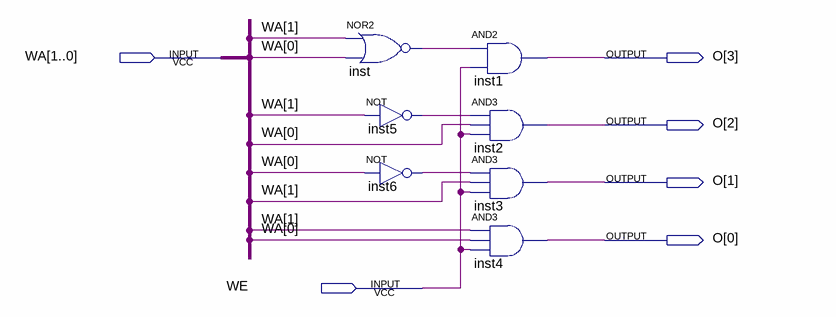
[diagram p0: schematic sheet]
// Quartus schematic Decoder2to4.bdf as structural Verilog: 7 symbols, 6 pins
module Decoder2to4 (
  input  [1:0] WA,
  input  WE,
  output [3:0] O
);

  wire inst5_out, inst6_out, inst_out;

  nor inst (inst_out, WA[1], WA[0]);
  not inst5 (inst5_out, WA[1]);
  not inst6 (inst6_out, WA[0]);
  and inst1 (O[3], inst_out, WE);
  and inst2 (O[2], inst5_out, WA[0], WE);
  and inst3 (O[1], inst6_out, WA[1], WE);
  and inst4 (O[0], WA[1], WA[0], WE);
endmodule
